# EAGLE design Taito Arkanoid paddle (EAGLE 6.6.0)
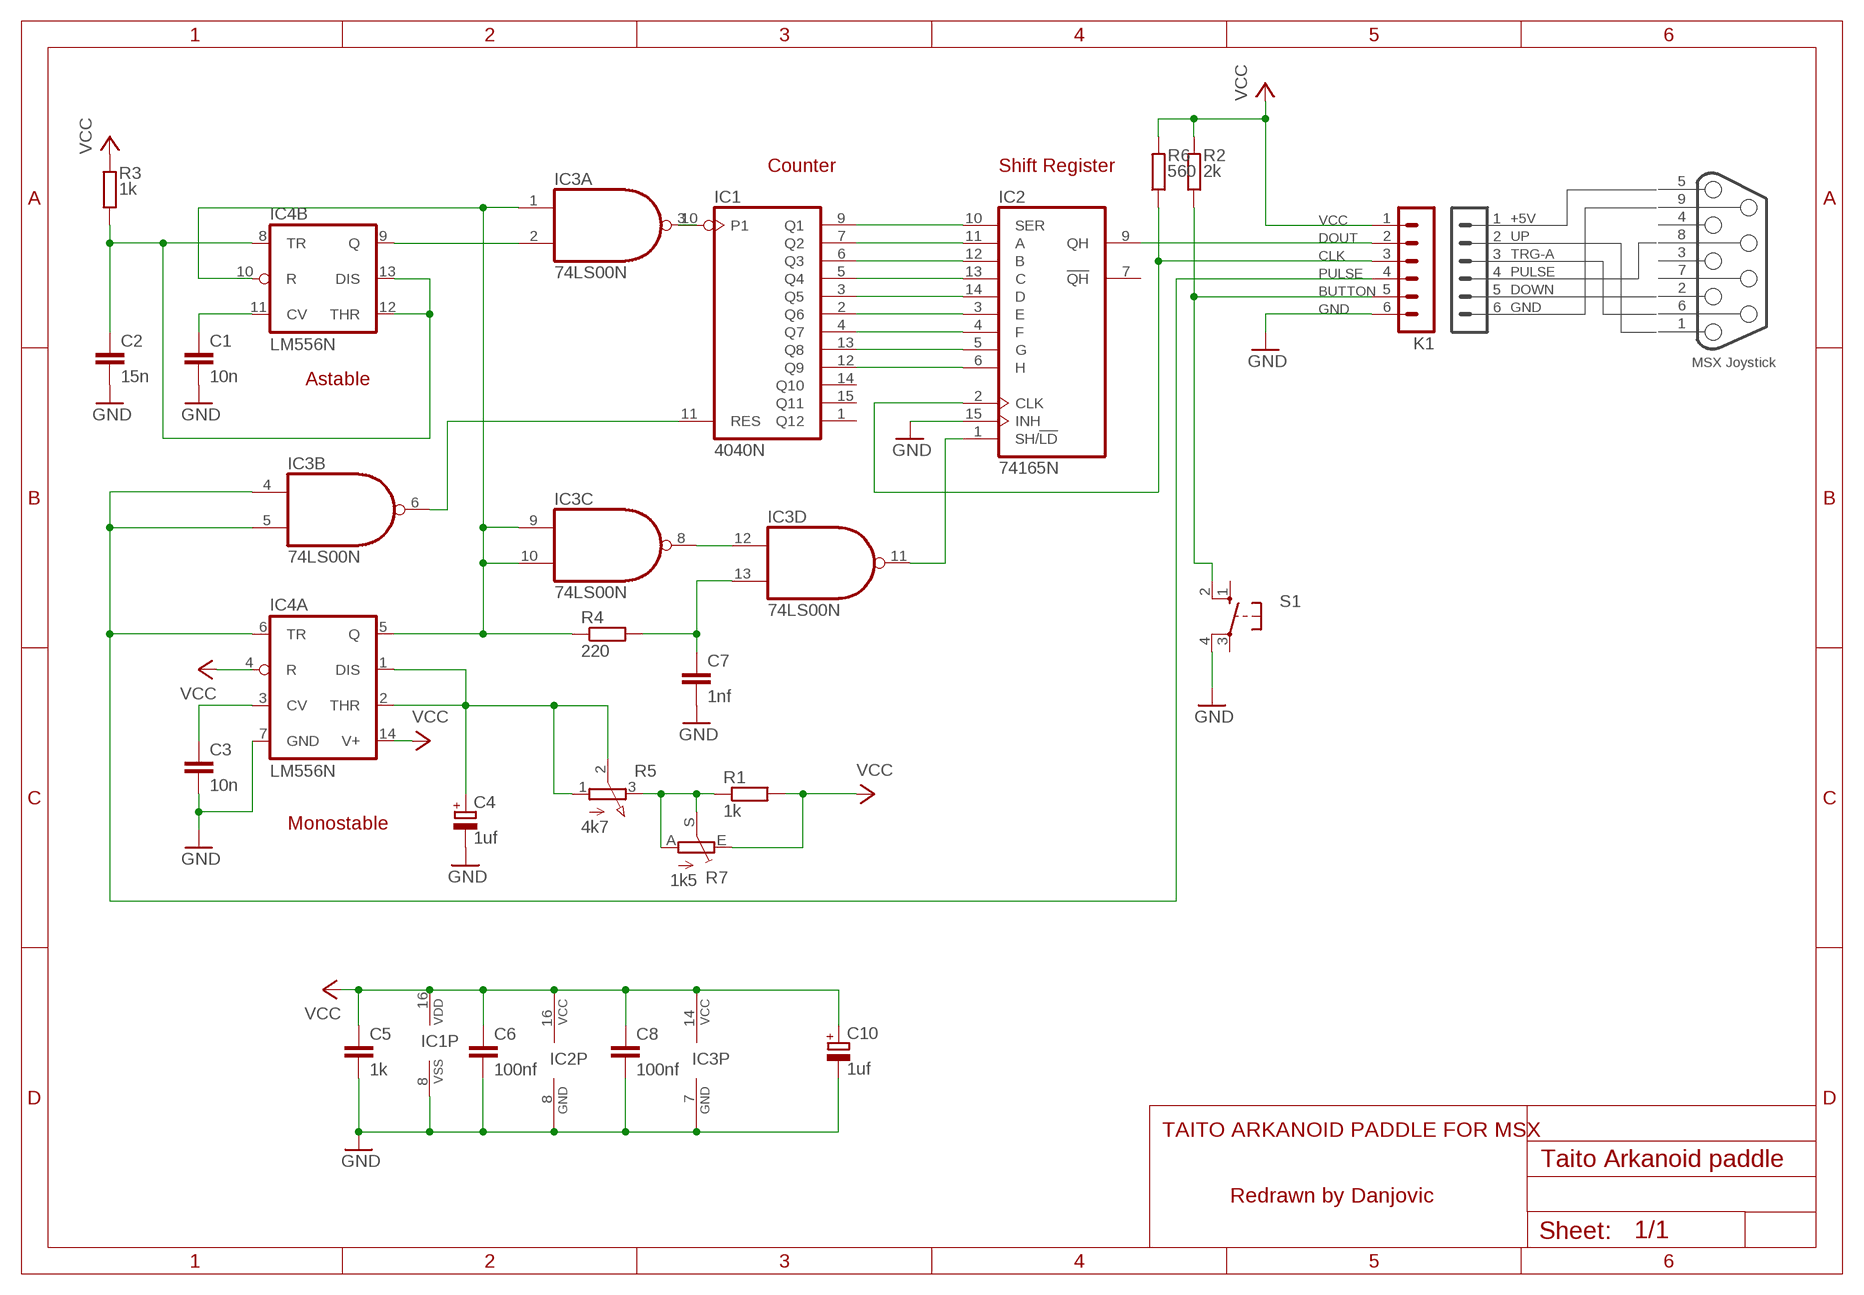
[diagram p0: schematic, sheet 1]

## Parts
C1  10n  C-EU050-024X044  [C050-024X044]
C2  15n  C-EU050-024X044  [C050-024X044]
C3  10n  C-EU050-024X044  [C050-024X044]
C4  1uf  CPOL-EUE2-4  [E2-4]
C5  1k  C-EU050-024X044  [C050-024X044]
C6  100nf  C-EU050-024X044  [C050-024X044]
C7  1nf  C-EU050-024X044  [C050-024X044]
C8  100nf  C-EU050-024X044  [C050-024X044]
C10  1uf  CPOL-EUE2-4  [E2-4]
IC1  4040N  [DIL16]
IC2  74165N  [DIL16]
IC3  74LS00N  [DIL14]
IC4  LM556N  [DIL14]
K1  MA06-1  [MA06-1]
R1  1k  R-EU_0207/7  [0207/7]
R2  2k  R-EU_0207/7  [0207/7]
R3  1k  R-EU_0207/7  [0207/7]
R4  220  R-EU_0207/7  [0207/7]
R5  4k7  3RP/1610NTHRU  [3RP/1610N_THRU]
R6  560  R-EU_0207/7  [0207/7]
R7  1k5  TRIM_EU-CT6  [CT6]
S1  40-XX  [B3F-40XX]

## Nets
BUTTON: K1.5 R2.1 S1.2(S1)
CLK: IC2.2(CLK) K1.3 R6.1
DOUT: IC2.9(QH) K1.2
GND: C1.2 C2.2 C3.2 C4.- C5.2 C6.2 C7.2 C8.2 C10.- IC1.8(VSS) IC2.8(GND) IC2.15(INH) IC3.7(P:GND) IC4.7(A:GND) K1.6 S1.4(P1)
N$1: IC2.1(SH/!LD) IC3.11(D:O)
N$2: IC1.2(Q6) IC2.3(E)
N$3: IC1.4(Q7) IC2.4(F)
N$4: IC1.13(Q8) IC2.5(G)
N$5: IC1.12(Q9) IC2.6(H)
N$6: IC1.9(Q1) IC2.10(SER)
N$7: IC1.7(Q2) IC2.11(A)
N$8: IC1.6(Q3) IC2.12(B)
N$9: IC1.5(Q4) IC2.13(C)
N$10: IC1.3(Q5) IC2.14(D)
N$11: IC3.8(C:O) IC3.12(D:I0)
N$12: IC3.1(A:I0) IC3.9(C:I0) IC3.10(C:I1) IC4.5(A:Q) IC4.10(B:R) R4.1
N$13: C7.1 IC3.13(D:I1) R4.2
N$14: C2.1 IC4.8(B:TR) IC4.12(B:THR) IC4.13(B:DIS) R3.1
N$15: R1.1 R5.3(E) R7.A R7.S
N$18: IC1.11(RES) IC3.6(B:O)
N$19: IC1.10(P1) IC3.3(A:O)
N$21: IC3.2(A:I1) IC4.9(B:Q)
N$22: C4.+ IC4.1(A:DIS) IC4.2(A:THR) R5.1(A) R5.2(S)
N$23: C1.1 IC4.11(B:CV)
N$26: C3.1 IC4.3(A:CV)
PULSE: IC3.4(B:I0) IC3.5(B:I1) IC4.6(A:TR) K1.4
VCC: C5.1 C6.1 C8.1 C10.+ IC1.16(VDD) IC2.16(VCC) IC3.14(P:VCC) IC4.4(A:R) IC4.14(A:V+) K1.1 R1.2 R2.2 R3.2 R6.2 R7.E
Unconnected: IC1.1(Q12) IC1.14(Q10) IC1.15(Q11) IC2.7(!QH) S1.1(S) S1.3(P)

## Notes on the sheet
- Counter | Shift Register
- 5
- 9
- 1 | +5V | 4
- 2 | UP | 8
- 3 | TRG-A | 3
- 4 | PULSE | 7
- 5 | DOWN | 2
- 6 | GND | 6
- 1
- MSX Joystick
- Astable
- Monostable
- TAITO ARKANOID PADDLE FOR MSX
- Redrawn by Danjovic

## Library data of the parts
C1-C3 C5-C8 = rcl:C-EU: CAPACITOR, European symbol
C4 C10 = rcl:CPOL-EU: POLARIZED CAPACITOR, European symbol
IC1 = 40xx:4040: 12-stage binary/ripple COUNTER
IC2 = 74xx-us:74*165: 8-bit parallel load SHIFT REGISTER
IC3 = 74xx-us:74*00: Quad 2-input NAND gate
IC4 = linear:*556: Dual TIMER
K1 = con-lstb:MA06-1: PIN HEADER; OC_FARNELL: unknown; OC_NEWARK: unknown
R1-R4 R6 = rcl:R-EU_: RESISTOR, European symbol
R5 = Pontentiometer:3RP/1610N: 16mm Potentiometer one level Source: http://www.alphapotentiometers.net/html/16mm_pot_2.html
R7 = pot:TRIM_EU-: POTENTIOMETER
S1 = switch-omron:40-XX: OMRON SWITCH; MF: OMRON COMPONENTS USA; MPN: B3F-4000; OC_FARNELL: 176434; OC_NEWARK: 36K3105

## Board
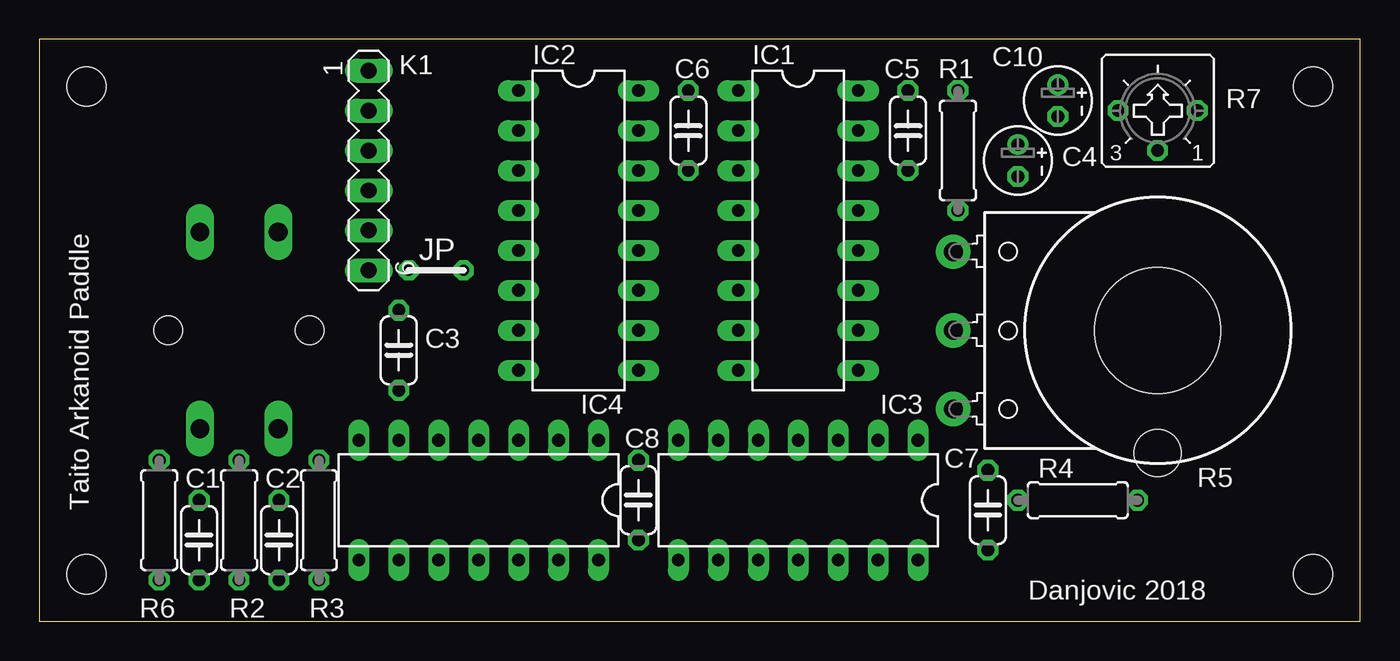
[diagram p1: board, top side]
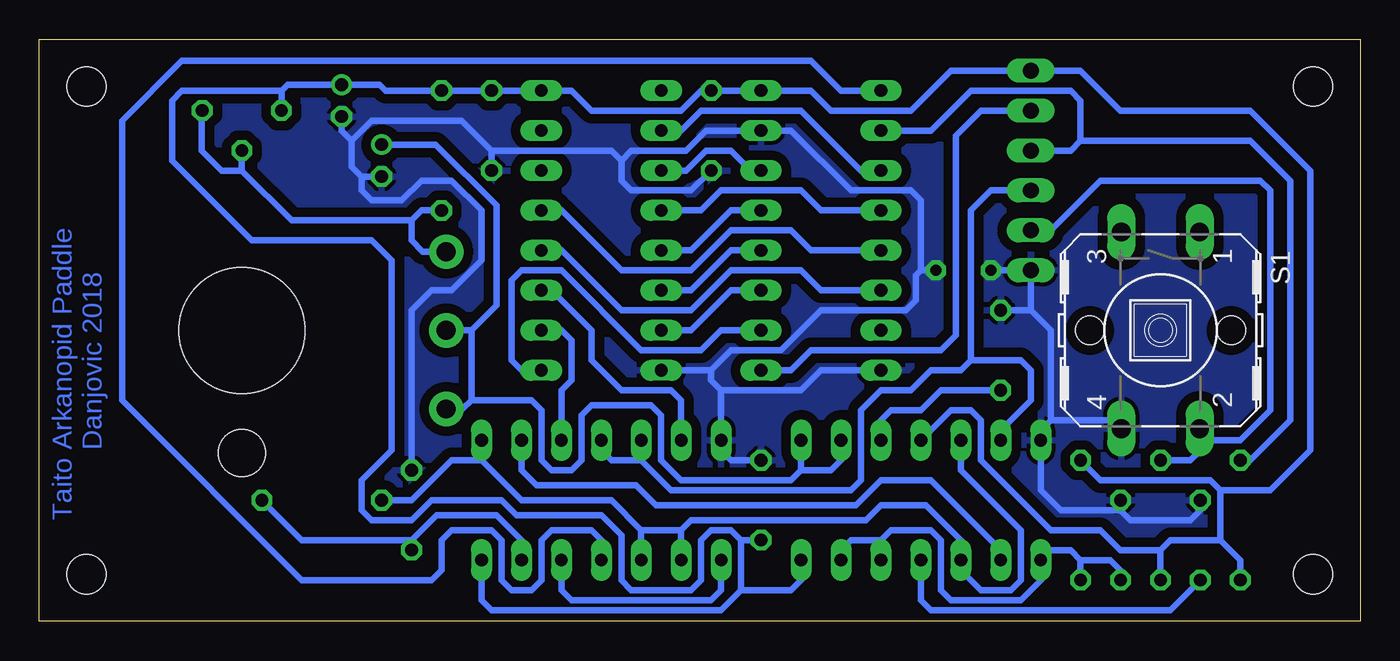
[diagram p2: board, bottom side, seen from below]

Size 84 x 37 mm. Coordinates in mm from the lower left corner, seen from the top.
Copper layers (1*16): Top 0.035mm / dielectric 1.5mm / Bottom 0.035mm
Design rules "default *": minimum track width 10mil, minimum drill 24mil, track to track 8mil, track to pad 8mil, pad to pad 8mil, via to via 8mil, smd to smd 8mil, copper to edge 25mil, drill to drill 8mil, minimum pad ring 10mil, minimum via ring 8mil, stop-mask expansion 4mil, vias tented up to drill 0mil, thermal gap 10mil

### Footprints (pad centres in the part's own frame; a part is rotated, then mirrored left to right if it is on the bottom)
C050-024X044 = drill 0.813 octagon: 1 -2.54,0; 2 2.54,0
E2-4 = drill 0.813 pad 1.27: + -1.016,0 | drill 0.813 pad 1.27 octagon: - 1.016,0
DIL16 = drill 0.813 long: 1 -8.89,-3.81; 2 -6.35,-3.81; 3 -3.81,-3.81; 4 -1.27,-3.81; 5 1.27,-3.81; 6 3.81,-3.81; 7 6.35,-3.81; 8 8.89,-3.81; 9 8.89,3.81; 10 6.35,3.81; 11 3.81,3.81; 12 1.27,3.81; 13 -1.27,3.81; 14 -3.81,3.81; 15 -6.35,3.81; 16 -8.89,3.81
DIL14 = drill 0.813 long: 1 -7.62,-3.81; 2 -5.08,-3.81; 3 -2.54,-3.81; 4 0,-3.81; 5 2.54,-3.81; 6 5.08,-3.81; 7 7.62,-3.81; 8 7.62,3.81; 9 5.08,3.81; 10 2.54,3.81; 11 0,3.81; 12 -2.54,3.81; 13 -5.08,3.81; 14 -7.62,3.81
MA06-1 = drill 1.016 long: 1 -6.35,0; 2 -3.81,0; 3 -1.27,0; 4 1.27,0; 5 3.81,0; 6 6.35,0
0207/7 = drill 0.813 octagon: 1 -3.81,0; 2 3.81,0
3RP/1610N_THRU = drill 1.2 pad 2.184: 1 -5,13; 2 0,13; 3 5,13 | hole 8: 0,0 | hole 3: -7.8,0
CT6 = drill 0.813 octagon: A 2.515,0; E -2.515,0; S 0,-2.54
B3F-40XX = drill 1.194 long: 1 -6.248,2.489; 2 6.248,2.489; 3 -6.248,-2.489; 4 6.248,-2.489 | hole 1.803: 0,-4.496; 0,4.496
CP-011 = hole 2.5: 3,-15.5; 3,15.5; 81,15.5; 81,-15.5

### Placement (x,y rotation side)
C1  10.16,5.17 90 top
C2  15.24,5.17 90 top
C3  22.86,17.23 90 top
C4  62.23,29.3 270 top
C5  55.24,31.2 270 top
C6  41.27,31.2 270 top
C7  60.33,7.07 90 top
C8  38.1,7.71 90 top
C10  64.77,33.11 270 top
IC1  48.26,24.85 270 top
IC2  34.29,24.85 270 top
IC3  48.26,7.71 180 top
IC4  27.94,7.71 180 top
K1  20.95,28.66 270 top
R1  58.42,29.93 90 top
R2  12.7,6.44 270 top
R3  17.78,6.44 90 top
R4  66.04,7.71 0 top
R5  71.12,18.5 90 top
R6  7.62,6.44 270 top
R7  71.12,32.47 0 top
S1  12.7,18.5 270 bottom
U$1  [CP-011]  0,18.5 0 top

### Tracks (layer width: path | path; a pad name or v marks a point on that pad's centre or on a via)
BUTTON
  Bottom 0.406: S1.2 10.21,11.52 | 10.21,11.52 10.21,10.83 10.79,10.25 R2.1 | K1.5 19.68,24.85 16.51,28.02 6.35,28.02 5.71,27.39 5.71,13.42 7.62,11.52 10.21,11.52
CLK
  Bottom 0.406: 17.78,30.57 17.78,33.11 18.41,33.74 24.77,33.74 27.3,31.2 IC2.2 | 17.78,30.57 18.41,29.93 K1.3 | 17.78,30.57 6.99,30.57 4.45,28.02 4.45,12.79 6.99,10.25 R6.1
DOUT
  Bottom 0.406: IC2.9 36.2,15.96 34.92,17.23 26.67,17.23 25.72,18.18 25.72,30.88 24.13,32.47 K1.2
GND  (via drill 0.7 pad 1.27)
  Top 0.406: v23.5,22.31 v26.99,22.31
  Bottom 0.406: IC1.8 41.27,15.96 | IC2.8 34.29,15.96 35.56,14.69 40.64,14.69 | 46.99,29.3 46.35,29.93 42.86,29.93 41.59,31.2 IC2.15 36.2,31.2 32.38,27.39 28.57,27.39 27.94,26.76 27.94,22.31 | 46.99,29.3 46.99,28.02 46.35,27.39 42.55,27.39 C6.2 | 55.24,29.93 47.62,29.93 46.99,29.3 | 41.27,15.96 40.01,17.23 36.83,17.23 34.29,19.77 28.89,19.77 28.26,20.41 28.26,21.99 27.94,22.31 | C8.2 40.01,10.25 40.64,10.88 IC3.7 40.64,14.69 | 55.24,29.93 C5.2 | 55.24,29.93 57.15,31.84 62.87,31.84 64.14,30.57 | 63.5,28.28 C4.- | 63.5,28.28 63.5,27.39 62.87,26.76 60.96,26.76 59.69,28.02 57.78,28.02 55.88,26.12 55.88,22.95 57.78,21.04 59.05,21.04 60.33,19.77 C7.2 | C10.- 64.77,31.2 64.14,30.57 | 41.27,15.96 41.27,15.33 40.64,14.69 | C1.2 10.16,7.07 10.79,6.44 14.61,6.44 15.24,7.07 | 15.24,7.07 19.05,7.07 20.32,8.34 IC4.7 20.32,12.15 19.68,12.79 | C2.2 15.24,7.07 | S1.4 15.34,12.25 15.88,12.79 19.68,12.79 | 19.68,12.79 19.68,18.5 20.95,19.77 | 20.95,19.77 K1.6 v23.5,22.31 | C3.2 20.95,19.77 | v26.99,22.31 27.94,22.31 | 64.14,30.57 64.14,28.91 63.5,28.28
  pour Bottom (isolate 0.61): 0,36.91 83.82,37.55 83.82,0.09 0,-0.55
N$1
  Bottom 0.406: IC3.11 48.26,5.17 48.9,5.8 51.44,5.8 52.07,5.17 52.07,2.63 52.7,1.99 53.98,1.99 54.61,2.63 54.61,5.17 55.24,5.8 57.78,5.8 58.42,5.17 58.42,3.26 59.05,2.63 67.31,2.63 78.74,14.05 78.74,31.84 74.93,35.65 34.92,35.65 33.02,33.74 IC2.1
N$2
  Bottom 0.406: IC1.2 43.18,31.2 41.91,32.47 35.56,32.47 31.75,28.66 IC2.3
N$3
  Bottom 0.406: IC2.4 34.29,26.12 35.56,27.39 40.64,27.39 41.91,26.12 IC1.4
N$4
  Bottom 0.406: IC2.5 34.92,23.58 36.2,24.85 40.01,24.85 42.55,22.31 46.99,22.31 50.8,26.12 IC1.13
N$5
  Bottom 0.406: IC2.6 34.29,21.04 35.56,22.31 40.01,22.31 42.55,19.77 46.99,19.77 50.8,23.58 IC1.12
N$6
  Bottom 0.406: IC2.10 40.64,18.5 41.91,17.23 45.72,17.23 50.8,22.31 53.34,22.31 53.98,21.68 53.98,16.6 53.34,15.96 IC1.9
N$7
  Bottom 0.406: IC2.11 40.01,21.04 42.55,18.5 IC1.7
N$8
  Bottom 0.406: IC2.12 40.01,23.58 42.55,21.04 IC1.6
N$9
  Bottom 0.406: IC2.13 40.01,26.12 42.55,23.58 IC1.5
N$10
  Bottom 0.406: IC2.14 38.73,28.66 40.01,29.93 41.59,29.93 42.86,28.66 IC1.3
N$11
  Bottom 0.406: IC3.12 50.8,1.99 50.16,1.36 41.27,1.36 40.64,1.99 IC3.8
N$12
  Bottom 0.406: R4.1 60.33,7.71 57.78,10.25 55.88,10.25 | 55.88,10.25 IC3.1 | 55.88,10.25 53.34,7.71 47.62,7.71 45.72,5.8 | IC4.5 25.4,9.61 21.59,5.8 21.59,2.63 22.23,1.99 24.13,1.99 25.4,3.26 IC4.10 25.4,5.17 27.62,7.39 30.48,7.39 31.43,6.44 42.55,6.44 43.18,5.8 | IC3.9 43.18,5.8 | 43.18,5.8 45.72,5.8 | 45.72,5.8 IC3.10
N$13
  Bottom 0.406: IC3.13 53.34,5.17 54.93,6.75 58.74,6.75 60.33,5.17 | C7.1 60.33,5.17 | 60.33,5.17 67.31,5.17 R4.2
N$14
  Bottom 0.406: 30.48,5.17 29.84,5.8 27.3,5.8 26.67,5.17 26.67,1.99 26.04,1.36 21.59,1.36 20.32,2.63 IC4.8 19.68,4.53 18.41,4.53 17.78,3.9 | IC4.13 33.02,4.53 32.38,5.17 30.48,5.17 | 30.48,5.17 IC4.12 | C2.1 15.24,3.26 15.88,3.9 17.78,3.9 | R3.1 17.78,3.9
N$15
  Bottom 0.406: 71.12,29.95 R7.S 71.12,28.66 | 71.12,28.66 67.94,25.48 60.33,25.48 | 71.12,28.66 72.39,28.66 73.66,29.93 73.66,32.45 R7.A | R1.1 59.69,26.12 60.33,25.48 | R5.3 59.61,23.5 60.33,24.21 60.33,25.48
N$18
  Bottom 0.406: IC3.6 43.18,14.05 43.81,14.69 46.99,14.69 48.9,16.6 48.9,18.5 51.44,21.04 IC1.11
N$19
  Bottom 0.406: IC1.10 50.8,18.5 50.16,17.87 50.16,15.33 50.8,14.69 IC3.3
N$21
  Bottom 0.406: IC3.2 53.34,9.61 52.39,8.66 46.04,8.66 44.77,7.39 32.07,7.39 30.48,8.98 27.3,8.98 22.86,4.53 IC4.9
N$22
  Bottom 0.406: 35.56,9.61 33.66,9.61 33.02,10.25 IC4.2 | 35.56,9.61 36.2,8.98 43.18,8.98 44.45,10.25 44.45,13.1 45.09,13.74 48.9,13.74 49.53,13.1 49.53,10.25 50.16,9.61 51.44,9.61 52.07,10.25 52.07,13.42 52.7,14.05 56.52,14.05 | 35.56,9.61 IC4.1 | C4.+ 58.8,30.31 54.93,26.44 54.93,20.09 56.52,18.5 | 56.52,18.5 56.52,14.05 | R5.1 57.07,13.5 56.52,14.05 | R5.2 56.52,18.5
N$23
  Bottom 0.406: C1.1 12.06,0.72 27.3,0.72 27.94,1.36 IC4.11
N$26
  Bottom 0.406: IC4.3 30.48,12.79 29.84,13.42 27.94,13.42 26.67,14.69 C3.1
PULSE
  Bottom 0.406: 24.77,16.6 24.77,26.12 23.5,27.39 K1.4 | 45.72,10.25 47.62,10.25 48.26,10.88 IC3.4 | IC3.5 45.72,10.25 | 45.72,10.25 43.81,8.34 32.38,8.34 31.75,8.98 31.75,13.42 30.48,14.69 28.57,14.69 27.3,15.96 25.4,15.96 24.77,16.6 | 24.77,16.6 21.59,16.6 20.95,15.96 20.95,14.05 22.86,12.15 IC4.6
VCC
  Bottom 0.406: 68.58,33.74 68.58,32.5 R7.E | IC4.14 35.56,2.63 36.2,1.99 39.37,1.99 | IC3.14 55.88,1.36 55.24,0.72 40.64,0.72 39.37,1.99 | IC4.4 26.04,13.42 24.77,13.42 24.13,12.79 24.13,10.25 19.68,5.8 16.51,5.8 15.24,4.53 12.7,4.53 | 8.89,5.17 12.06,5.17 12.7,4.53 | 39.37,5.17 39.37,1.99 | C8.1 39.37,5.17 | 39.37,5.17 40.01,5.8 41.27,5.8 41.91,5.17 41.91,2.63 42.55,1.99 46.35,1.99 46.99,2.63 46.99,5.48 48.26,6.75 53.66,6.75 54.61,7.71 59.05,7.71 60.33,6.44 62.87,6.44 63.5,7.07 63.5,8.98 61.59,10.88 61.59,22.95 62.87,24.21 70.48,24.21 75.56,29.3 75.56,33.11 74.93,33.74 68.58,33.74 | 68.58,33.74 68.2,34.12 C10.+ 62.36,34.12 61.98,33.74 R1.2 C5.1 IC1.16 50.16,33.74 48.9,32.47 43.18,32.47 41.91,33.74 C6.1 IC2.16 34.92,33.74 33.66,32.47 28.57,32.47 26.04,35.01 K1.1 17.78,35.01 15.24,32.47 6.99,32.47 3.17,28.66 3.17,10.88 5.71,8.34 8.89,8.34 | R3.2 16.51,8.98 9.53,8.98 8.89,8.34 | 8.89,8.34 8.89,5.17 | R2.2 12.7,4.53 | R6.2 7.62,3.9 8.89,5.17

### Text on the board
Bottom: Danjovic 2018 | Taito Arkanopid Paddle
tPlace: JP | Taito Arkanoid Paddle | Danjovic 2018